# Altium project jetson-orin-baseboard.PrjPcb (part 5 of 5)
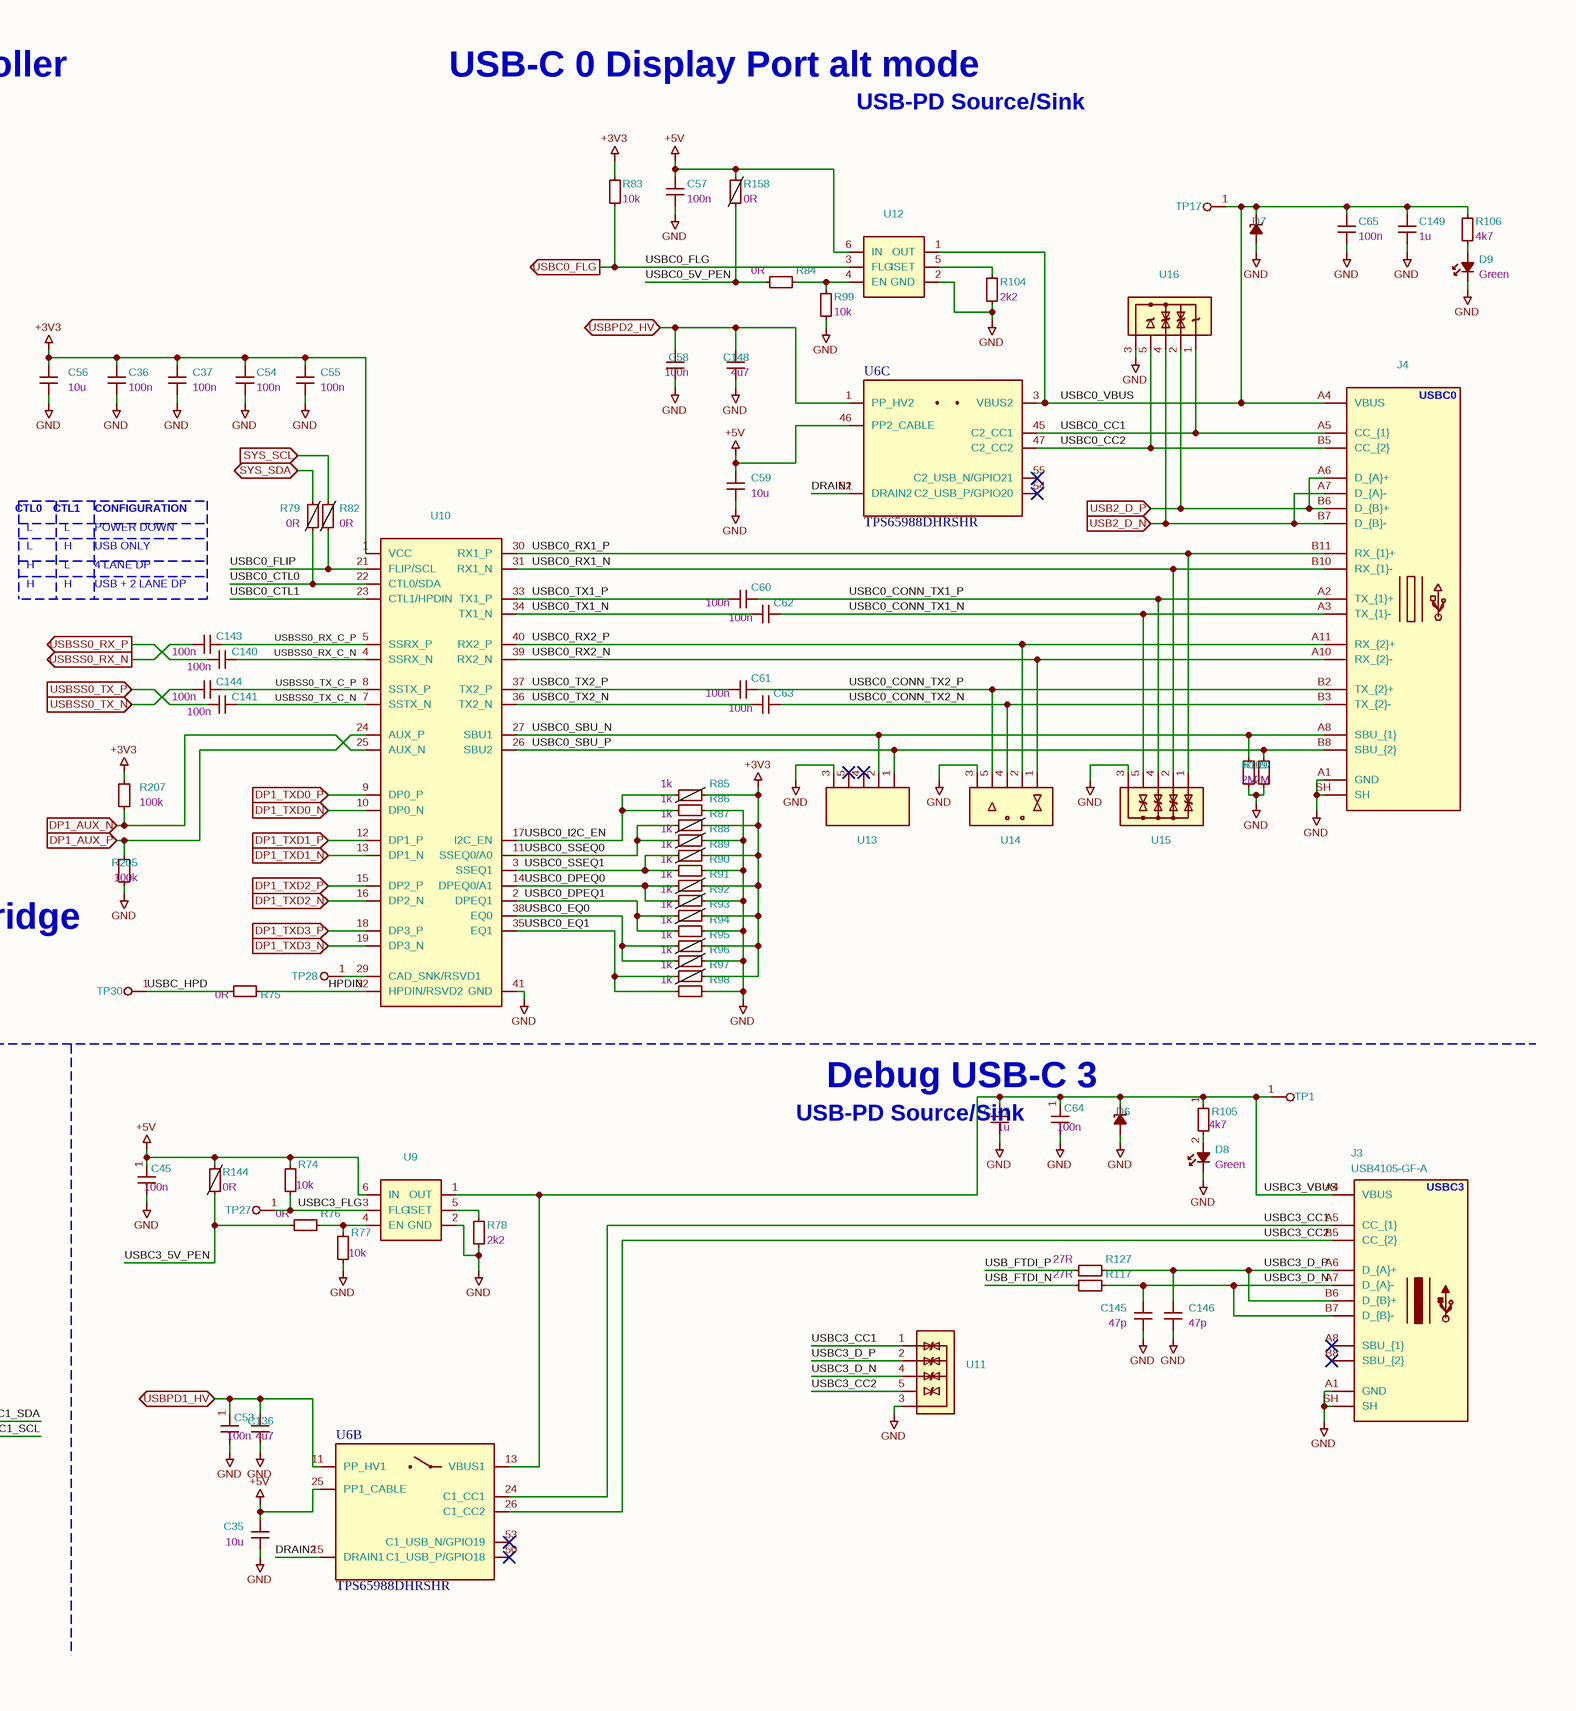
[diagram p16: usb.SchDoc, right]

## Nets that join several sheets
+1V8: hdmi (Q1.1 R47.2), supply (#FLG03.1 D31.1 R276.2 TP55.1), som (C40.2 R80.2 U4.3 U4.6), csi (12 pins), peripherals (7 pins)
+3V3: hdmi (13 pins), usb3 (7 pins), supply (#FLG06.1 D33.1 R178.2 TP54.1), som (C41.2 U4.7), csi (14 pins), m-2 (17 pins), ethernet (J6.15 J6.17), peripherals (10 pins), usb (22 pins)
+5V: hdmi (FB4.1), usb3 (9 pins), supply (6 pins), csi (C42.1 C90.1 U24.6 U27.6), peripherals (C48.2 J10.2 R235.2 U33.7), usb (11 pins)
GND: jetson-orin-baseboard (H3.1 H4.1 H5.1 H6.1), hdmi (19 pins), usb3 (22 pins), supply (78 pins), som (12 pins), csi (49 pins), m-2 (18 pins), ethernet (10 pins), peripherals (75 pins), usb (76 pins)
VCC: supply (20 pins), peripherals (R248.1)
VDD_SoM: supply (U29.6 U48.6), som (FB1.1)
3V3_STDB: supply (14 pins), som (D34.2), peripherals (R247.2)
CAN_RX: som (J15.143), peripherals (R335.1)
CAN_TX: som (J15.145), peripherals (R336.1)
CSI0_CLK_N: som (J15.10), csi (J7.10)
CSI0_CLK_P: som (J15.12), csi (J7.11)
CSI0_D0_N: som (J15.4), csi (J7.7)
CSI0_D0_P: som (J15.6), csi (J7.8)
CSI0_D1_N: som (J15.16), csi (J7.5)
CSI0_D1_P: som (J15.18), csi (J7.6)
CSI1_CLK_N: som (J15.9), csi (J8.10)
CSI1_CLK_P: som (J15.11), csi (J8.11)
CSI1_D0_N: som (J15.3), csi (R103.2 R107.3)
CSI1_D0_P: som (J15.5), csi (R103.1 R107.4)
CSI1_D1_N: som (J15.15), csi (R103.4 R107.1)
CSI1_D1_P: som (J15.17), csi (R103.3 R107.2)
CSI2_CLK_N: som (J15.28), csi (J7.28)
CSI2_CLK_P: som (J15.30), csi (J7.29)
CSI2_D0_N: som (J15.22), csi (J7.25)
CSI2_D0_P: som (J15.24), csi (J7.26)
CSI2_D1_N: som (J15.34), csi (J7.23)
CSI2_D1_P: som (J15.36), csi (J7.24)
CSI3_CLK_N: som (J15.27), csi (J8.28)
CSI3_CLK_P: som (J15.29), csi (J8.29)
CSI3_D0_N: som (J15.21), csi (R108.1 R122.4)
CSI3_D0_P: som (J15.23), csi (R108.2 R122.3)
CSI3_D1_N: som (J15.33), csi (R108.3 R122.2)
CSI3_D1_P: som (J15.35), csi (R108.4 R122.1)
CSIA_FLG: csi (R66.2 U24.3 U25.3), peripherals (R195.1)
CSIA_PEN: csi (R6.2 R193.1 U24.4 U25.4), peripherals (R25.1)
CSIB_FLG: csi (R67.2 U27.3 U28.3), peripherals (R195.2)
CSIB_PEN: csi (R180.2 R194.1 U27.4 U28.4), peripherals (R25.2)
DEBUG_RXD: som (U4.8), usb (R56.2)
DEBUG_TXD: som (U4.1), usb (R57.2)
DISABLE_POE_DCDC: ethernet (U39.1), peripherals (R25.4)
DP1_AUX_N: hdmi (C138.1), usb (R207.1 U10.25)
DP1_AUX_P: hdmi (C139.1), usb (R205.1 U10.24)
DP1_HDMI_AUX_N: hdmi (U36.4), som (J15.98)
DP1_HDMI_AUX_P: hdmi (U36.3), som (J15.100)
DP1_HPD: hdmi (R40.2 TP21.1), som (J15.96)
DP1_TXD0_HDMI_TX2_N: hdmi (C92.2), som (J15.63)
DP1_TXD0_HDMI_TX2_P: hdmi (C135.2), som (J15.65)
DP1_TXD0_N: hdmi (U36.31), usb (U10.10)
DP1_TXD0_P: hdmi (U36.32), usb (U10.9)
DP1_TXD1_HDMI_TX1_N: hdmi (C88.2), som (J15.69)
DP1_TXD1_HDMI_TX1_P: hdmi (C133.2), som (J15.71)
DP1_TXD1_N: hdmi (U36.33), usb (U10.13)
DP1_TXD1_P: hdmi (U36.34), usb (U10.12)
DP1_TXD2_HDMI_TX0_N: hdmi (C87.2), som (J15.75)
DP1_TXD2_HDMI_TX0_P: hdmi (C132.2), som (J15.77)
DP1_TXD2_N: hdmi (U36.35), usb (U10.16)
DP1_TXD2_P: hdmi (U36.36), usb (U10.15)
DP1_TXD3_HDMI_TXC_N: hdmi (C86.2), som (J15.81)
DP1_TXD3_HDMI_TXC_P: hdmi (C131.2), som (J15.83)
DP1_TXD3_N: hdmi (U36.37), usb (U10.19)
DP1_TXD3_P: hdmi (U36.38), usb (U10.18)
EEPROM_PWR: peripherals (#FLG07.1 J9.1), usb (6 pins)
FAN_PWM: som (J15.230), peripherals (U33.5)
FAN_TACH: som (J15.208), peripherals (U33.4)
GBE_LED_ACT: som (J15.194), ethernet (R151.2)
GBE_LED_LINK: som (J15.188), ethernet (R152.2)
GBE_MDI0_N: som (J15.184), ethernet (J6.2)
GBE_MDI0_P: som (J15.186), ethernet (J6.1)
GBE_MDI1_N: som (J15.190), ethernet (J6.6)
GBE_MDI1_P: som (J15.192), ethernet (J6.3)
GBE_MDI2_N: som (J15.196), ethernet (J6.8)
GBE_MDI2_P: som (J15.198), ethernet (J6.7)
GBE_MDI3_N: som (J15.202), ethernet (J6.10)
GBE_MDI3_P: som (J15.204), ethernet (J6.9)
GPIO01: som (J15.118), peripherals (R26.7)
GPIO07: som (J15.206), peripherals (R26.8)
GPIO09: som (J15.211), peripherals (R53.7)
GPIO010: usb3 (R245.1), som (J15.212 R80.1), usb (R244.2)
GPIO11: som (J15.216), peripherals (R100.7)
GPIO12: som (R2.2), peripherals (R100.8)
GPIO13: som (R3.2), peripherals (R64.5)
I2C1_SCL: som (J15.189), peripherals (D56.2 J14.4)
I2C1_SDA: som (J15.191), peripherals (D57.2 J14.3)
I2C2_SCL: som (J15.232), peripherals (R121.2 U30.5)
I2C2_SDA: som (J15.234), peripherals (R120.2 U30.4)
I2S0_LRCK: som (J15.197), peripherals (R54.6)
I2S0_SCLK: som (J15.199), peripherals (R100.5)
I2S0_SDIN: som (J15.195), peripherals (R54.5)
I2S0_SDOUT: som (J15.193), peripherals (R101.8)
I2S1_LRCK: som (J15.224), m-2 (R21.2)
I2S1_SCLK: som (J15.226), m-2 (R21.1)
I2S1_SDIN: som (J15.222), m-2 (R21.3)
I2S1_SDOUT: som (J15.220), m-2 (R21.4)
MODULE_ID: supply (R275.1 U48.1 U48.4), som (J15.217)
PCIE0_CLK_N: som (J15.160), m-2 (J2.53)
PCIE0_CLK_P: som (J15.162), m-2 (J2.55)
PCIE0_CLKREQ*: som (J15.180), m-2 (R17.1 U2.3 U3.6)
PCIE0_RST*: som (J15.181), m-2 (R18.1 U3.4)
PCIE0_RX0_N: som (J15.131), m-2 (J2.41)
PCIE0_RX0_P: som (J15.133), m-2 (J2.43)
PCIE0_RX1_N: som (J15.137), m-2 (J2.29)
PCIE0_RX1_P: som (J15.139), m-2 (J2.31)
PCIE0_RX2_N: som (J15.149), m-2 (J2.17)
PCIE0_RX2_P: som (J15.151), m-2 (J2.19)
PCIE0_RX3_N: som (J15.155), m-2 (J2.5)
PCIE0_RX3_P: som (J15.157), m-2 (J2.7)
PCIE0_TX0_N: som (J15.134), m-2 (C17.2)
PCIE0_TX0_P: som (J15.136), m-2 (C13.2)
PCIE0_TX1_N: som (J15.140), m-2 (C18.2)
PCIE0_TX1_P: som (J15.142), m-2 (C14.2)
PCIE0_TX2_N: som (J15.148), m-2 (C19.2)
PCIE0_TX2_P: som (J15.150), m-2 (C15.2)
PCIE0_TX3_N: som (J15.154), m-2 (C20.2)
PCIE0_TX3_P: som (J15.156), m-2 (C16.2)
PCIE1_CLK_N: som (J15.173), m-2 (J1.49)
PCIE1_CLK_P: som (J15.175), m-2 (J1.47)
PCIE1_CLKREQ*: som (J15.182), m-2 (J1.53 R28.2)
PCIE1_RST*: som (J15.183), m-2 (J1.52 R27.2)
PCIE1_RX0_N: som (J15.167), m-2 (J1.43)
PCIE1_RX0_P: som (J15.169), m-2 (J1.41)
PCIE1_TX0_N: som (J15.172), m-2 (C10.1)
PCIE1_TX0_P: som (J15.174), m-2 (C9.1)
PCIE2_CLK_N: som (J15.52), peripherals (D43.1 J11.15)
PCIE2_CLK_P: som (J15.54), peripherals (D44.1 J11.17)
PCIE2_CLKREQ*: som (J15.221), peripherals (R26.6)
PCIE2_RST*: som (J15.219), peripherals (R26.5)
PCIE2_RX0_N: som (J15.40), peripherals (D39.1 J11.12)
PCIE2_RX0_P: som (J15.42), peripherals (D40.1 J11.14)
PCIE2_RX1_N: som (J15.58), peripherals (D45.1 J11.6)
PCIE2_RX1_P: som (J15.60), peripherals (D46.1 J11.8)
PCIE2_TX0_N: som (J15.46), peripherals (C108.2)
PCIE2_TX0_P: som (J15.48), peripherals (C109.2)
PCIE2_TX1_N: som (J15.64), peripherals (C112.2)
PCIE2_TX1_P: som (J15.66), peripherals (C110.2)
PCIE3_CLK_N: som (J15.227), peripherals (D49.1 J11.18)
PCIE3_CLK_P: som (J15.229), peripherals (D50.1 J11.20)
PCIE3_CLKREQ*: som (J15.225), peripherals (R64.7)
PCIE3_RST*: som (J15.223), peripherals (R64.8)
PCIE_WAKE*: som (J15.179), m-2 (R13.1 R14.1 R15.1)
PCIE_WAKE_SEL_EXT: m-2 (R15.2), peripherals (R64.6)
PDC_MISO: peripherals (R204.5), usb (R131.1 U7.2)
PDC_MOSI: peripherals (R204.7), usb (U7.5)
PDC_SCLK: peripherals (R204.6), usb (U7.6)
POE_OUTPUT: supply (Q14.4 Q16.3), ethernet (6 pins)
POWER_EN: supply (R260.2), som (J15.237)
PWR_SOFT: supply (Q7.1 R249.2), usb (R58.2)
SCL_CAM: som (J15.213), csi (R162.2)
SDA_CAM: som (J15.215), csi (R161.2)
SPI1_MISO: som (J15.108), peripherals (R101.5)
SPI1_MOSI: som (J15.104), peripherals (R101.6)
SPI1_SCK: som (J15.106), peripherals (R101.7)
SPIO_MISO: som (J15.93), peripherals (R63.6)
SPIO_MOSI: som (J15.89), peripherals (R54.8)
SPIO_SCK: som (J15.91), peripherals (R54.7)
SYS_SCL: usb3 (R125.1), som (J15.185), m-2 (R31.2), peripherals (R62.1 R112.8 R216.1 U30.2), usb (R70.2 R82.2)
SYS_SDA: usb3 (R124.1), som (J15.187), m-2 (R30.2), peripherals (5 pins), usb (R71.2 R79.2)
UART0_CTS: som (J15.105), m-2 (R22.2)
UART0_RTS: som (J15.103), m-2 (R22.3)
UART0_RXD: som (J15.101), m-2 (R22.4)
UART0_TXD: som (J15.99), m-2 (R22.1)
UART1_RXD: som (J15.205), peripherals (R53.8)
UART1_TXD: som (J15.203), peripherals (R100.6)
USB0_D_N: usb3 (J5.A7 J5.B7 U21.4), som (J15.109)
USB0_D_P: usb3 (J5.A6 J5.B6 U21.2), som (J15.111)
USB1_D_N: som (J15.115), m-2 (R52.1), peripherals (D22.1 R134.2)
USB1_D_P: som (J15.117), m-2 (R20.1), peripherals (D23.1 R141.2)
USB2_D_N: som (J15.121), usb (J4.A7 J4.B7 U16.4)
USB2_D_P: som (J15.123), usb (J4.A6 J4.B6 U16.2)
USB_FLASH_ID: usb3 (Q19.3 R23.2), som (J15.87)
USBC0_FLG: peripherals (R195.4), usb (R83.1 U12.3)
USBC1_FLG: usb3 (R138.1 U18.3), peripherals (R195.3)
USBC1_PEN: usb3 (R136.1 R137.2 R184.1), peripherals (R25.3)
USBC_HPD: hdmi (Q3.1 U36.19), usb (R65.2)
USBPD1_HV: supply (R252.1), usb (C53.1 C136.1 U6.11)
USBPD2_HV: supply (R253.1), usb (C58.1 C148.1 U6.1)
USBSS0_RX_N: som (J15.161), usb (C143.1)
USBSS0_RX_P: som (J15.163), usb (C140.1)
USBSS0_TX_N: som (J15.166), usb (C144.1)
USBSS0_TX_P: som (J15.168), usb (C141.1)
USBSS1_RX_N: som (J15.39), peripherals (D16.1 J11.24)
USBSS1_RX_P: som (J15.41), peripherals (D17.1 J11.26)
USBSS1_TX_N: som (J15.45), peripherals (C113.2)
USBSS1_TX_P: som (J15.47), peripherals (C111.2)
USBSS2_RX_N: usb3 (R201.1), som (J15.51)
USBSS2_RX_P: usb3 (R200.1), som (J15.53)
USBSS2_TX_N: usb3 (R203.1), som (J15.57)
USBSS2_TX_P: usb3 (R202.1), som (J15.59)
USER_BTN0: som (J15.128), peripherals (D58.2 R232.1 S2.1 S2.2)
USER_BTN1: som (J15.130), peripherals (D59.2 R242.1 S3.1 S3.2)
USER_LED0: som (J15.126), peripherals (Q9.1 R222.2)
USER_LED1: som (J15.127), peripherals (Q10.1 R230.2)
VSYNC_CAM0: som (R12.2), csi (U31.5)
VSYNC_CAM1: som (R11.2), csi (U31.4)
VSYNC_CAM2: som (R4.2), csi (U32.5)
VSYNC_CAM3: som (R5.2), csi (U32.4)
~{{GPIO_INT}}: som (R1.2), peripherals (R219.1 U34.11)
~{{PDC_CS}}: peripherals (R204.8), usb (U7.1)
~{{RESET}}: supply (6 pins), som (J15.239), usb (Q20.1 R271.2)
~{{SHUTDOWN_REQ}}: supply (R236.2), som (J15.233)
~{{SPI0_CS0}}: som (J15.95), peripherals (R63.7)
~{{SPI0_CS1}}: som (J15.97), peripherals (R63.8)
~{{SPI1_CS0}}: som (J15.110), peripherals (R102.6)
~{{SPI1_CS1}}: som (J15.112), peripherals (R102.5)